# Altium schematic sheet [05] - CPU - POWER.SchDoc: DOCUMENT TITLE
size A4; Organization: Tor Brodtkorb; Address1: Frode Rinnans veg 193; Address2: 7050 Trondheim; DocumentNumber: 6598; Revision: 1.0; SheetNumber: 1; SheetTotal: 1
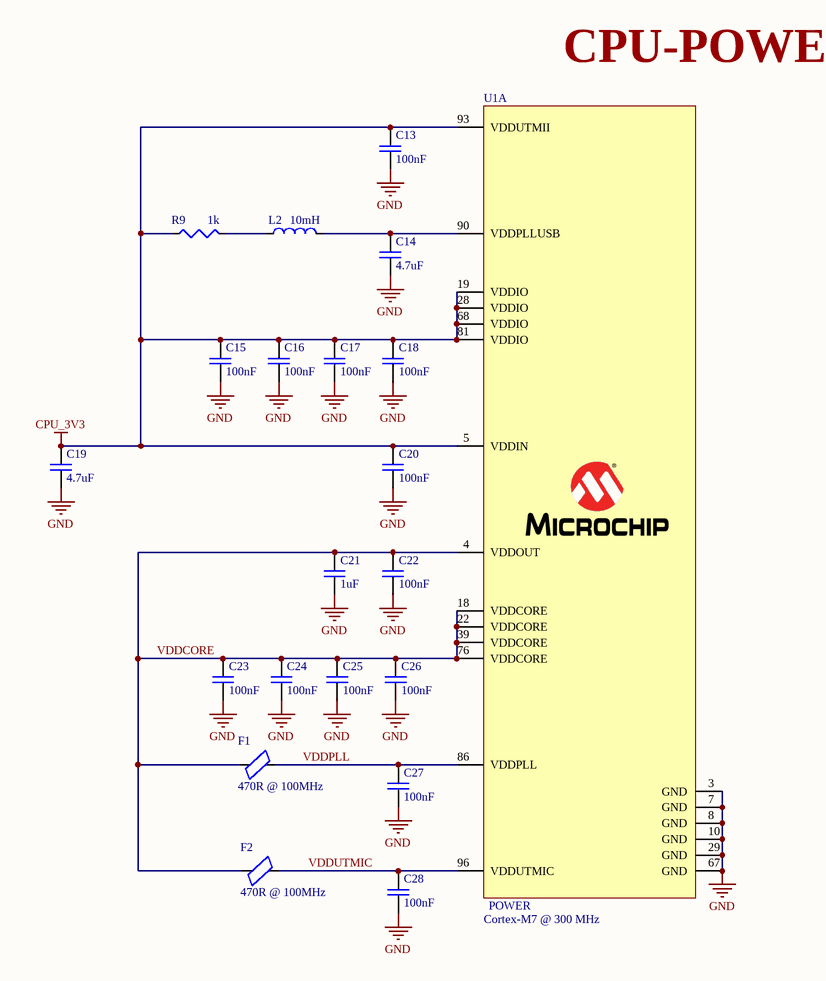
[diagram p0: [05] - CPU - POWER.SchDoc]

## Parts
C13  value 100nF  [C0603]  (hidden comment: 02016D104KAT2A)
C14  value 4.7uF  [C0603]  (hidden comment: 02016D104KAT2A)
C15  value 100nF  [C0603]  (hidden comment: 02016D104KAT2A)
C16  value 100nF  [C0603]  (hidden comment: 02016D104KAT2A)
C17  value 100nF  [C0603]  (hidden comment: 02016D104KAT2A)
C18  value 100nF  [C0603]  (hidden comment: 02016D104KAT2A)
C19  value 4.7uF  [C0603]  (hidden comment: 02016D104KAT2A)
C20  value 100nF  [C0603]  (hidden comment: 02016D104KAT2A)
C21  value 1uF  [C0603]  (hidden comment: 02016D104KAT2A)
C22  value 100nF  [C0603]  (hidden comment: 02016D104KAT2A)
C23  value 100nF  [C0603]  (hidden comment: 02016D104KAT2A)
C24  value 100nF  [C0603]  (hidden comment: 02016D104KAT2A)
C25  value 100nF  [C0603]  (hidden comment: 02016D104KAT2A)
C26  value 100nF  [C0603]  (hidden comment: 02016D104KAT2A)
C27  value 100nF  [C0603]  (hidden comment: 02016D104KAT2A)
C28  value 100nF  [C0603]  (hidden comment: 02016D104KAT2A)
F1  value 470R @ 100MHz  [Ferrite bead 0603]  (hidden comment: BLM18AG121SN1D)
F2  value 470R @ 100MHz  [Ferrite bead 0603]  (hidden comment: BLM18AG121SN1D)
L2  value 10mH  [Inductor 0603]  (hidden comment: MLZ1608A2R2WT)
R9  value 1k  [R0603]  (hidden comment: CPF-A-0603B100KE1)
U1  Cortex-M7 @ 300 MHz  [ATSAMS70N19A-AN]  (part A of 3)

## Nets
CPU_3V3: C13.2 C15.2 C16.2 C17.2 C18.2 C19.2 C20.2 R9.1 U1.5(VDDIN) U1.19(VDDIO) U1.28(VDDIO) U1.68(VDDIO) U1.81(VDDIO) U1.93(VDDUTMII)
GND: C13.1 C14.1 C15.1 C16.1 C17.1 C18.1 C19.1 C20.1 C21.1 C22.1 C23.1 C24.1 C25.1 C26.1 C27.1 C28.1 U1.3(GND) U1.7(GND) U1.8(GND) U1.10(GND) U1.29(GND) U1.67(GND)
VDDCORE: C21.2 C22.2 C23.2 C24.2 C25.2 C26.2 F1.1 F2.1 U1.4(VDDOUT) U1.18(VDDCORE) U1.22(VDDCORE) U1.39(VDDCORE) U1.76(VDDCORE)
VDDPLL: C27.2 F1.2 U1.86(VDDPLL)
VDDUTMIC: C28.2 F2.2 U1.96(VDDUTMIC)
NetC14_2: C14.2 L2.2 U1.90(VDDPLLUSB)
NetL2_1: L2.1 R9.2

## Notes on the sheet
- (near U1) CPU-POWER
- Title
- Size:
- Date:
- A4
- Number:
- Time:
- Revision:
- Sheet
- of
- File:
- (in symbol ATSAMS70N19A-AN, part A) POWER

## Library data of the parts
C13-C28 = 02016D104KAT2A: C0603
F1 F2 = BLM18AG121SN1D: Ferrite bead 0603
L2 = MLZ1608A2R2WT: Inductor 0603
R9 = CPF-A-0603B100KE1: R0603
U1 = ATSAMS70N19A-AN: ATSAMS70N19; Supplier Part Number 1: 2484390; Supplier 1: Farnell